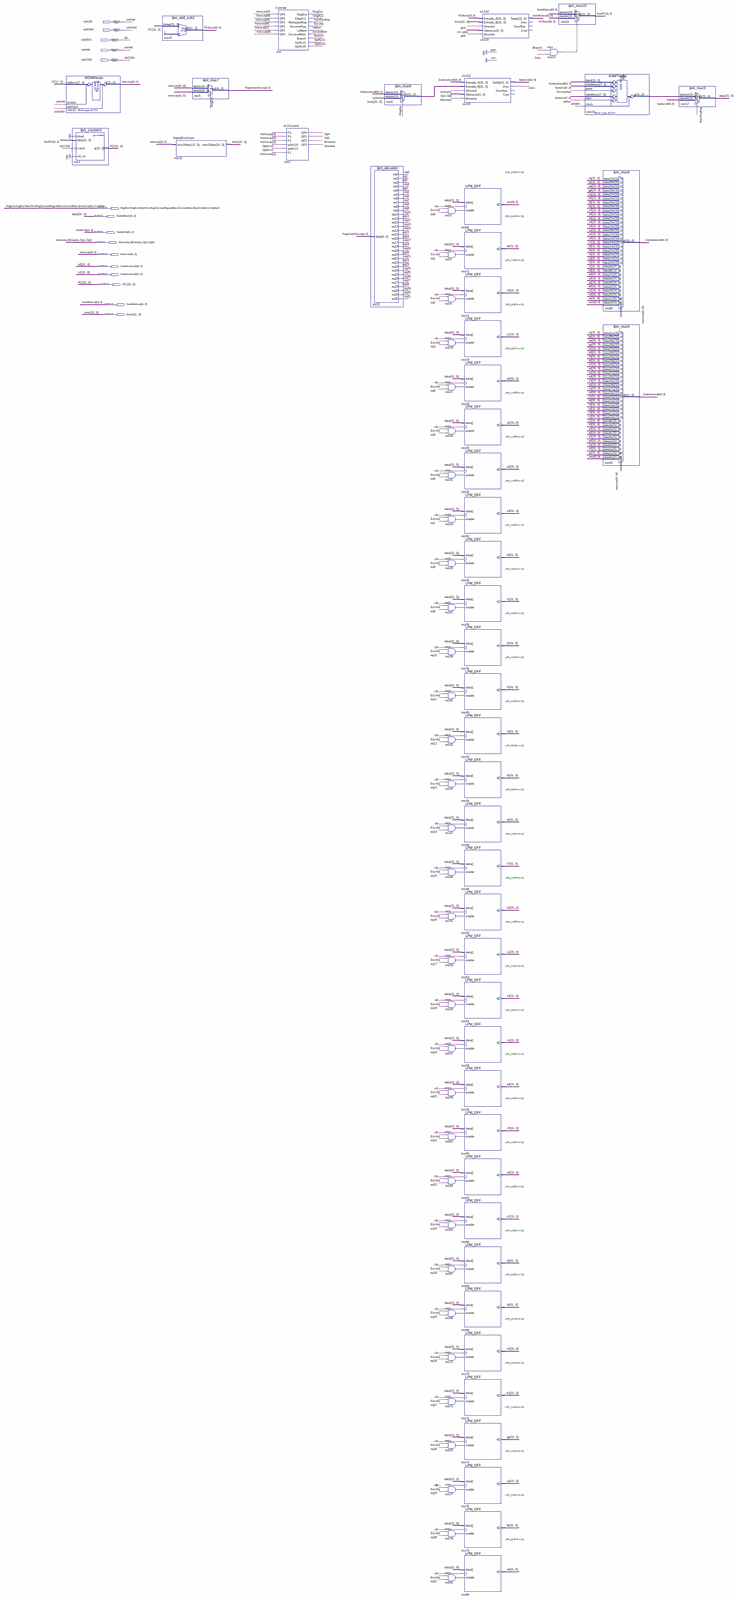
[diagram p0: schematic sheet, whole]
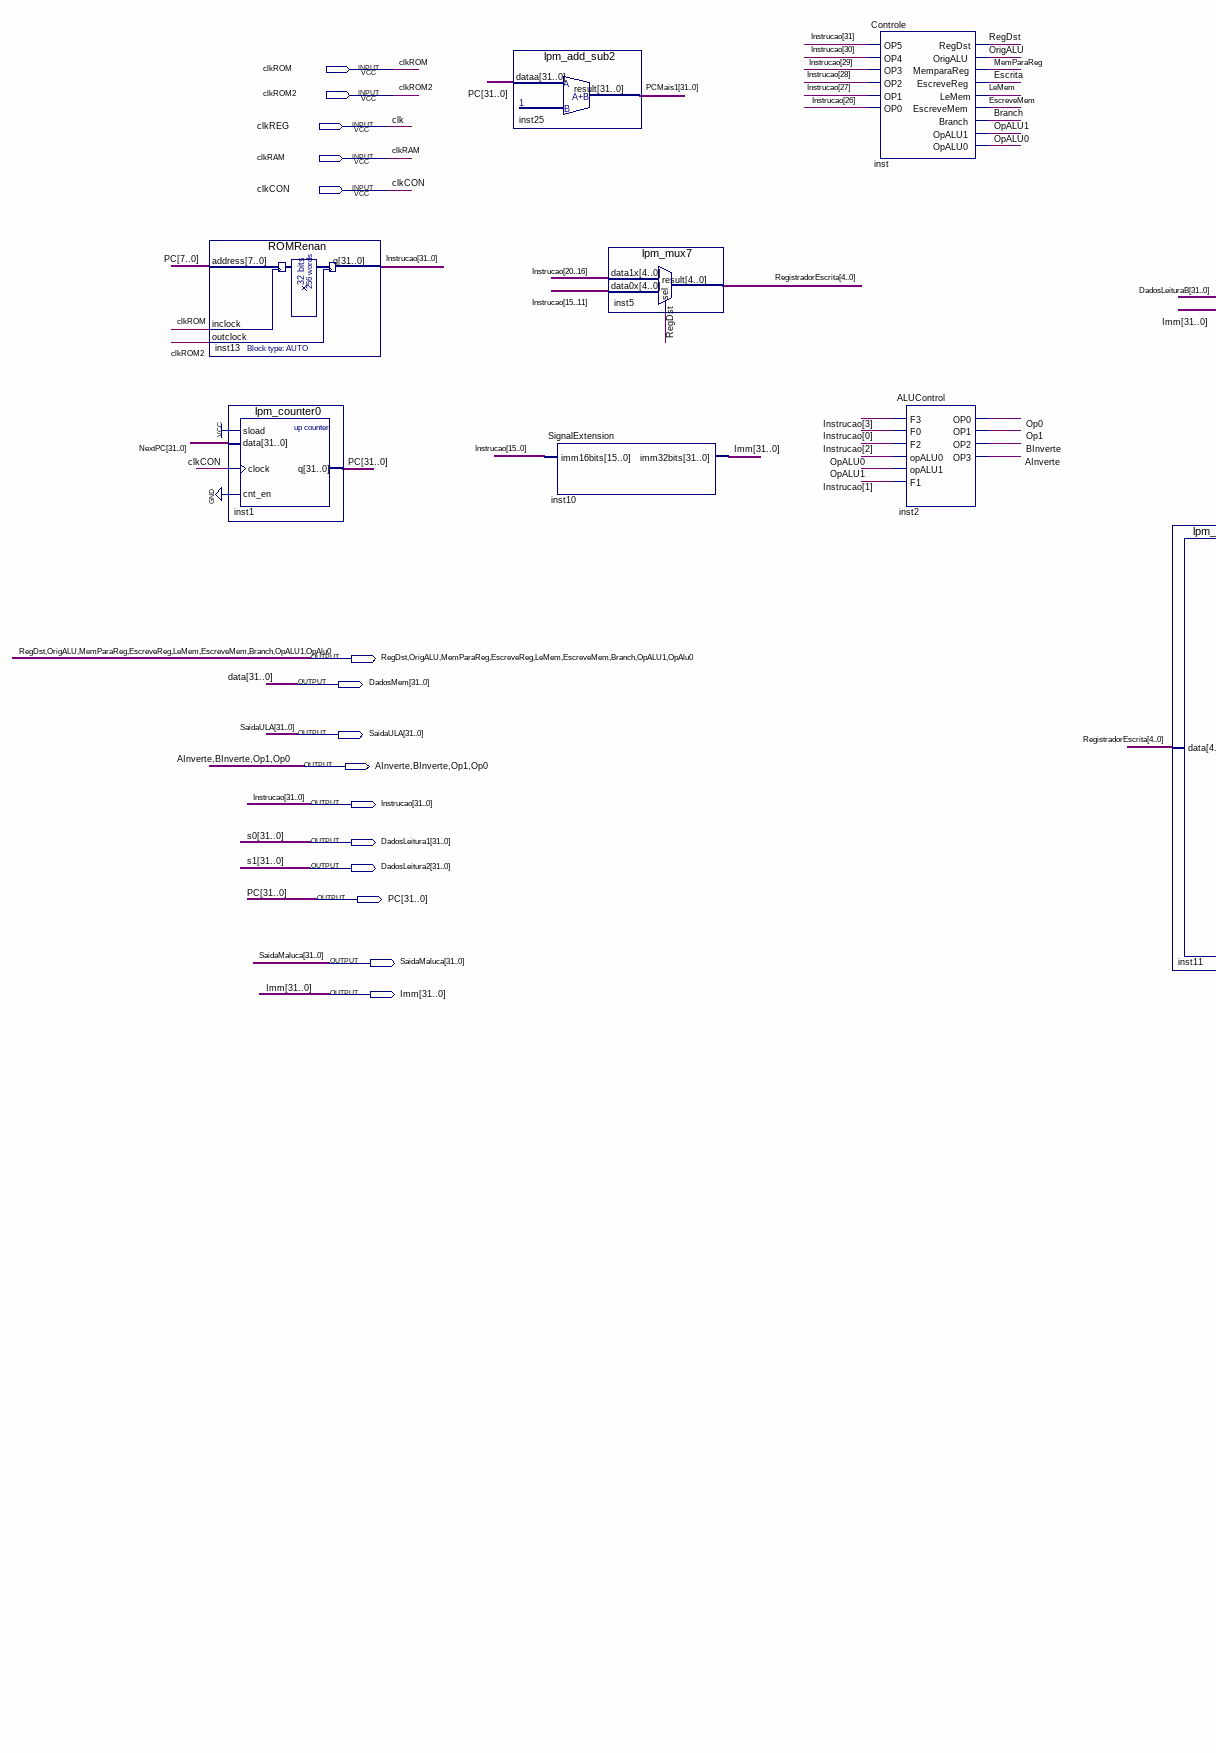
[diagram p1: schematic sheet, upper left part]
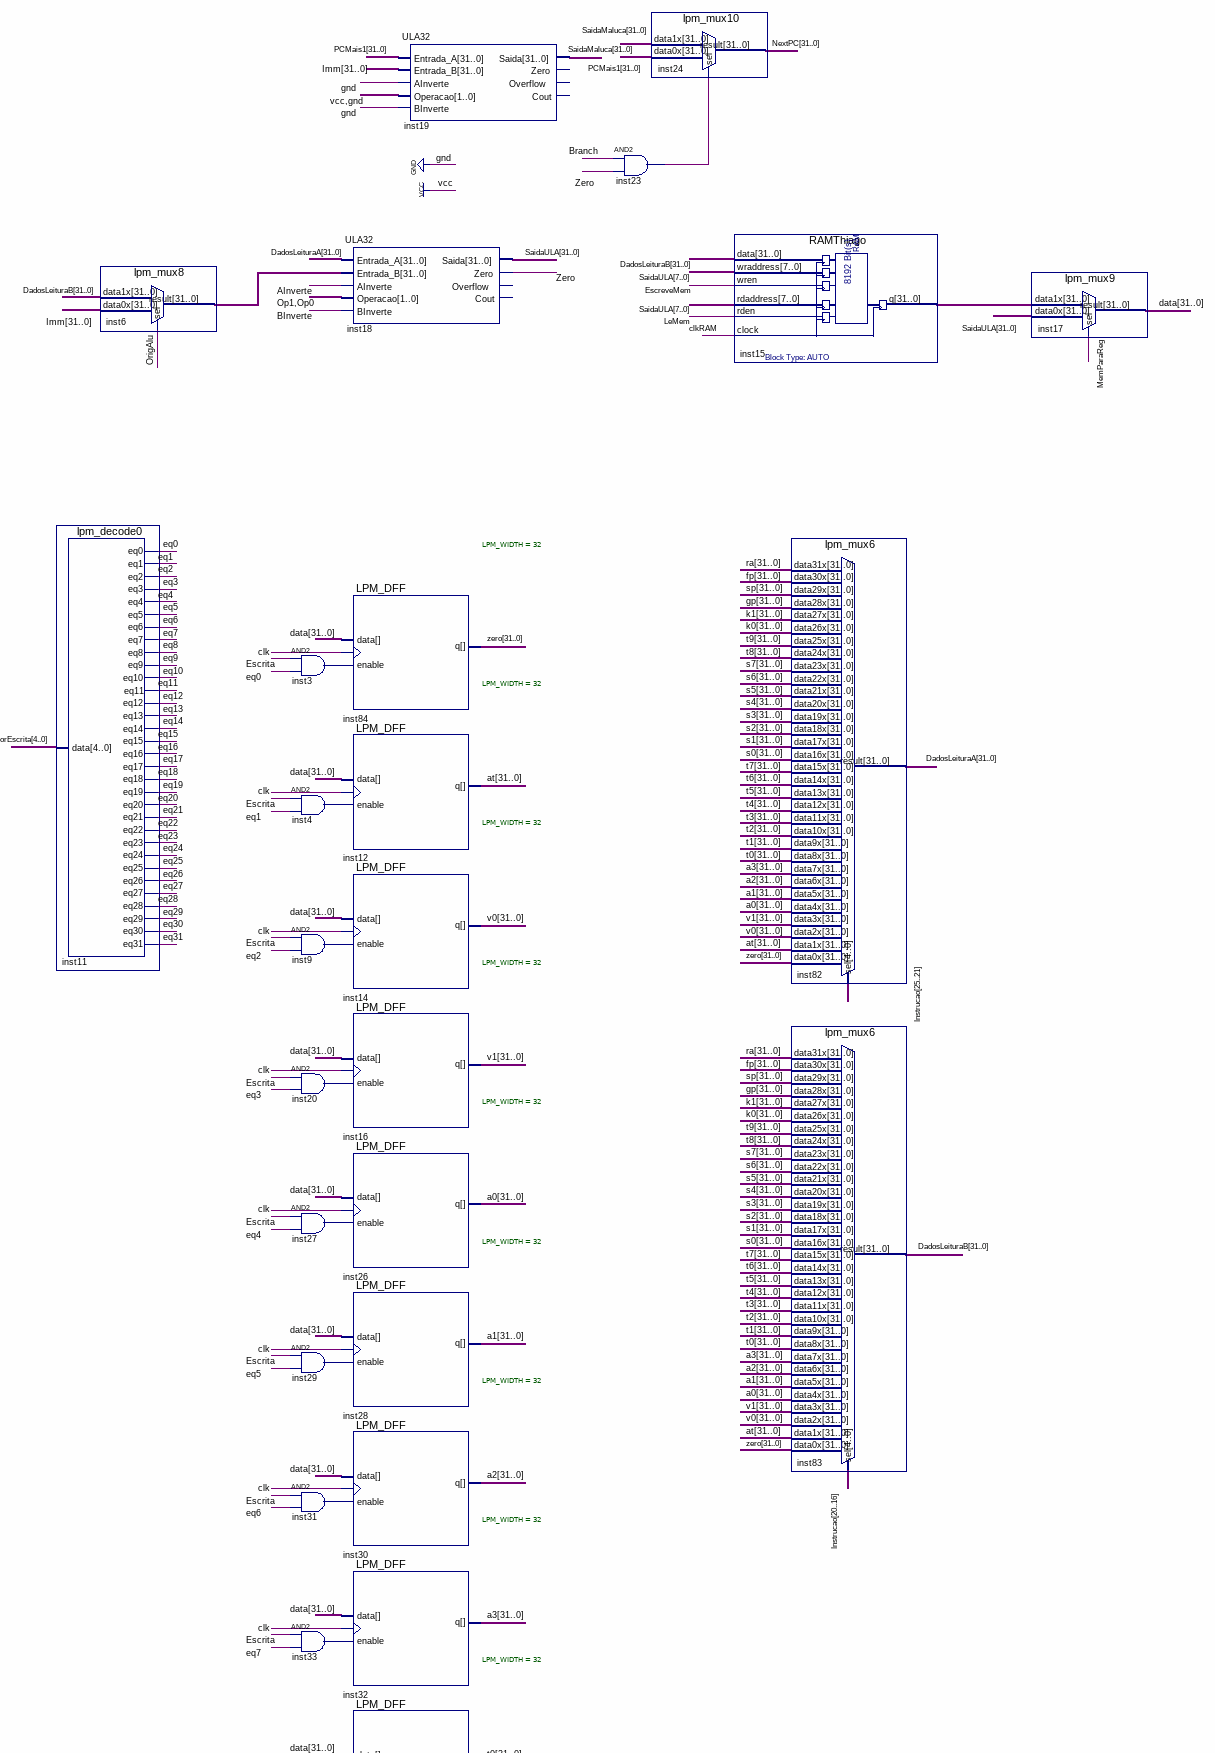
[diagram p2: schematic sheet, upper right part]
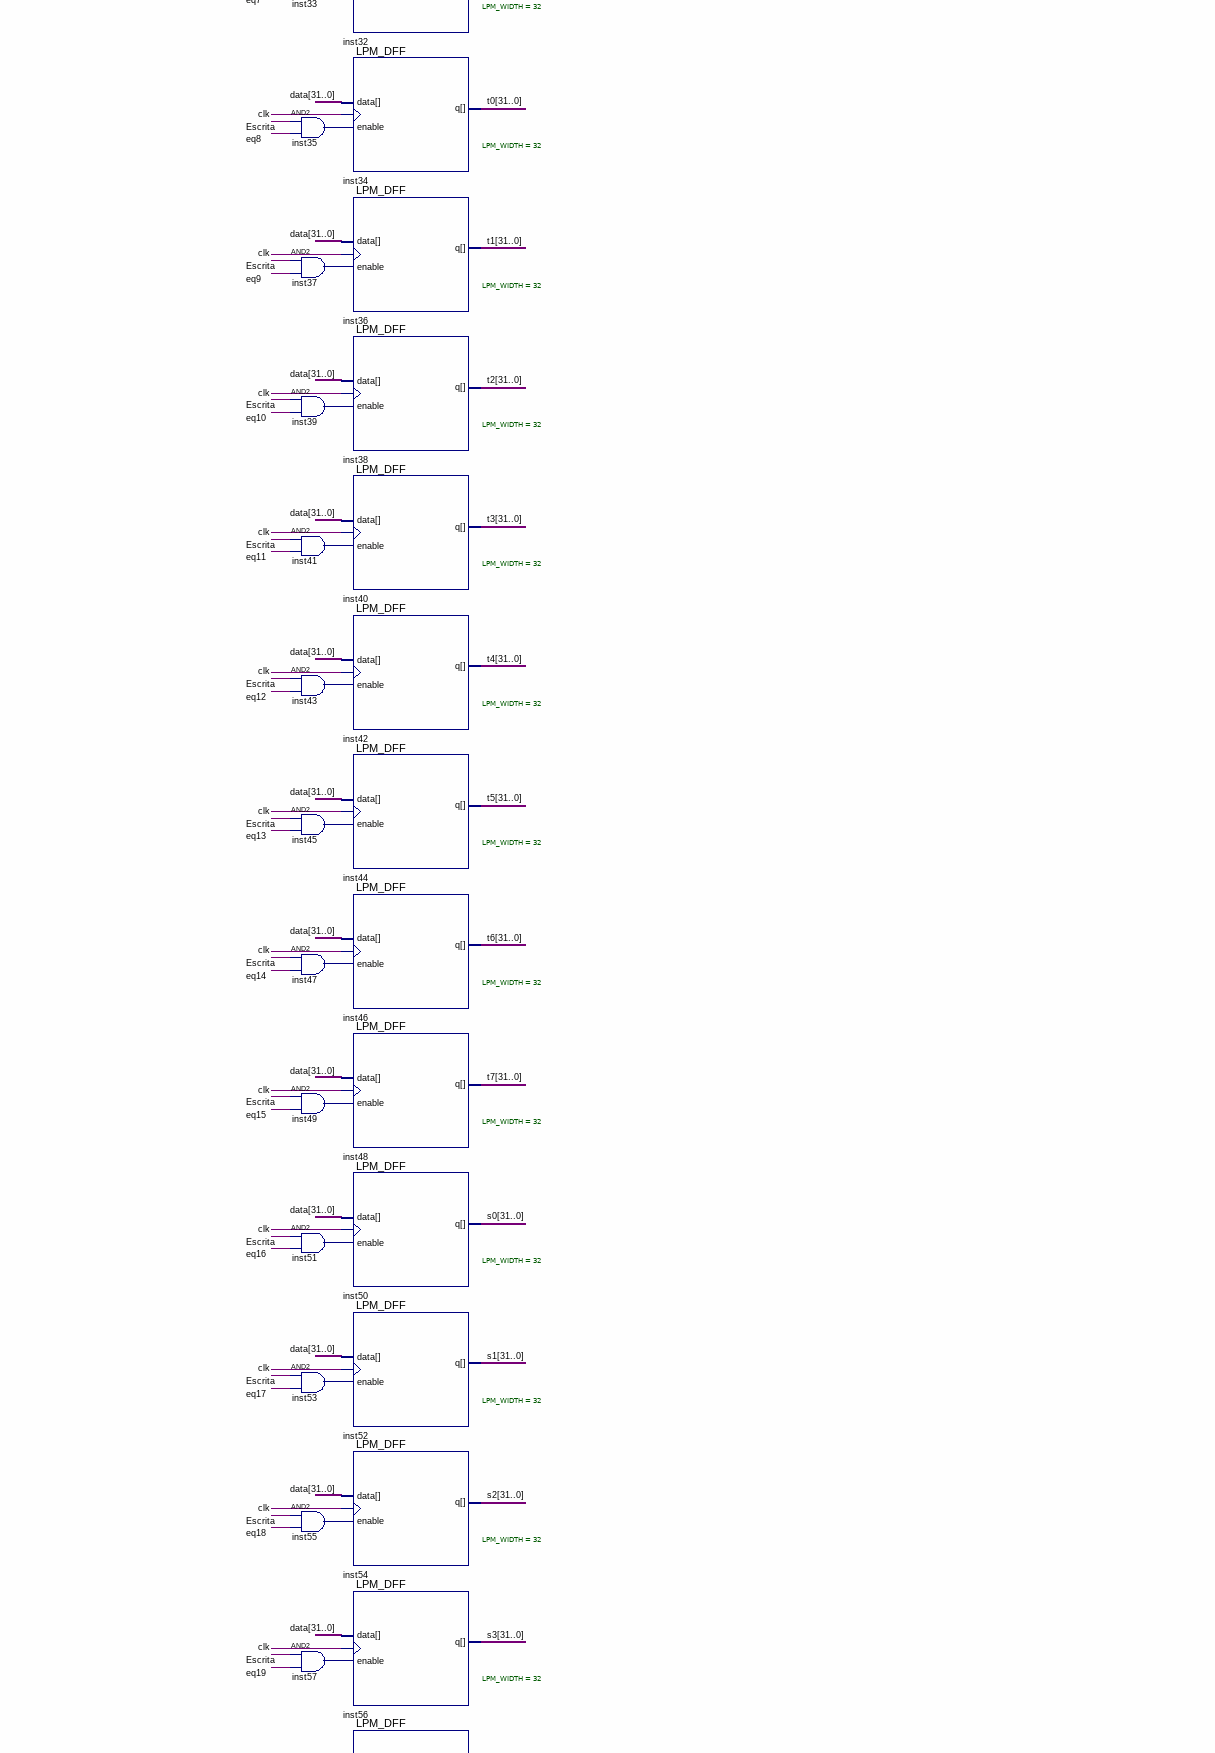
[diagram p3: schematic sheet, middle right part]
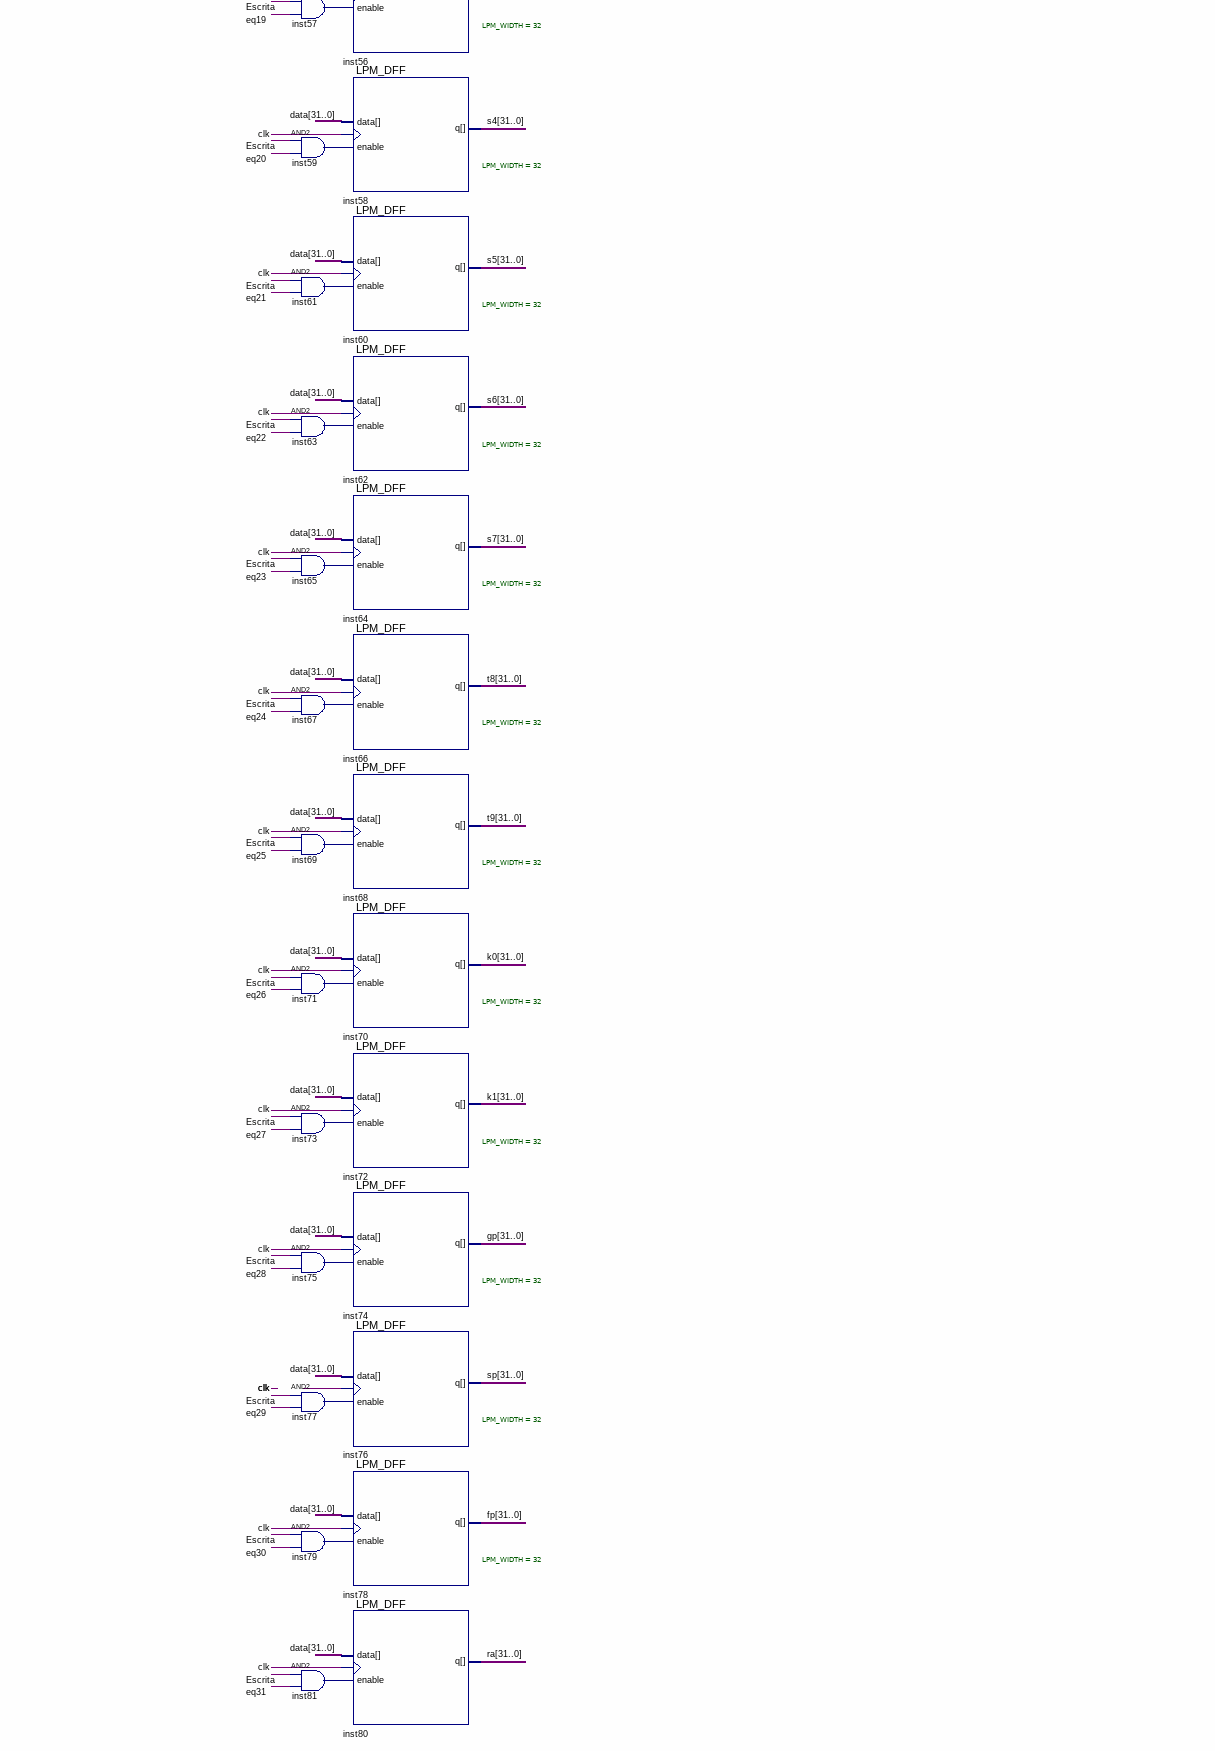
[diagram p4: schematic sheet, lower right part]
// Quartus schematic GambiarraRegD.bdf as structural Verilog: 81 symbols, 15 pins
module GambiarraRegD (
  input  clkROM,
  input  clkROM2,
  input  clkREG,
  input  clkRAM,
  input  clkCON,
  output RegDst,
  output OrigALU,
  output MemParaReg,
  output EscreveReg,
  output LeMem,
  output EscreveMem,
  output Branch,
  output OpALU1,
  output OpAlu0,
  output [31:0] DadosMem,
  output [31:0] SaidaULA,
  output AInverte,
  output BInverte,
  output Op1,
  output Op0,
  output [31:0] Instrucao,
  output [31:0] DadosLeitura1,
  output [31:0] DadosLeitura2,
  output [31:0] PC,
  output [31:0] SaidaMaluca,
  output [31:0] Imm
);

  wire eq0, eq1, eq2, eq3, eq4, eq5, eq6, eq7, eq8, eq9, eq10, eq11, eq12, eq13, eq14, eq15, eq16, eq17,
       eq18, eq19, eq20, eq21, eq22, eq23, eq24, eq25, eq26, eq27, eq28, eq29, eq30, eq31, Escrita,
       inst3_out, inst4_out, inst9_out, inst20_out, inst23_out, inst27_out, inst29_out, inst31_out,
       inst33_out, inst35_out, inst37_out, inst39_out, inst41_out, inst43_out, inst45_out, inst47_out,
       inst49_out, inst51_out, inst53_out, inst55_out, inst57_out, inst59_out, inst61_out, inst63_out,
       inst65_out, inst67_out, inst69_out, inst71_out, inst73_out, inst75_out, inst77_out, inst79_out,
       inst81_out, Zero_1bit;
  wire [4:0] RegistradorEscrita;
  wire [31:0] a0, a1, a2, a3, at, DadosLeituraA, DadosLeituraB, fp, gp, inst6_result, inst15_q, k0, k1,
       NextPC, PCMais1, ra, s2, s3, s4, s5, s6, s7, sp, t0, t1, t2, t3, t4, t5, t6, t7, t8, t9, v0, v1, Zero;

  ROMRenan inst13 (.address(PC[7:0]), .inclock(clkROM), .outclock(clkROM2), .q(Instrucao));
  lpm_counter0 inst1 (.sload(1'b1), .data(NextPC), .clock(clkCON), .cnt_en(1'b0), .q(PC));
  lpm_add_sub2 inst25 (.dataa(PC), .result(PCMais1));
  SignalExtension inst10 (.imm16bits(Instrucao[15:0]), .imm32bits(Imm));
  lpm_mux7 inst5 (.data1x(Instrucao[20:16]), .data0x(Instrucao[15:11]), .sel(RegDst), .result(RegistradorEscrita));
  Controle inst (
    .OP5(Instrucao[31]), .OP4(Instrucao[30]), .OP3(Instrucao[29]), .OP2(Instrucao[28]), .OP1(Instrucao[27]),
    .OP0(Instrucao[26]), .RegDst(RegDst), .OrigALU(OrigALU), .MemparaReg(MemParaReg), .EscreveReg(Escrita),
    .LeMem(LeMem), .EscreveMem(EscreveMem), .Branch(Branch), .OpALU1(OpALU1), .OpALU0(OpAlu0));
  ALUControl inst2 (
    .F3(Instrucao[3]), .F0(Instrucao[0]), .F2(Instrucao[2]), .opALU0(OpAlu0), .opALU1(OpALU1),
    .F1(Instrucao[1]), .OP0(Op0), .OP1(Op1), .OP2(BInverte), .OP3(AInverte));
  lpm_decode0 inst11 (
    .data(RegistradorEscrita), .eq0(eq0), .eq1(eq1), .eq2(eq2), .eq3(eq3), .eq4(eq4), .eq5(eq5), .eq6(eq6),
    .eq7(eq7), .eq8(eq8), .eq9(eq9), .eq10(eq10), .eq11(eq11), .eq12(eq12), .eq13(eq13), .eq14(eq14),
    .eq15(eq15), .eq16(eq16), .eq17(eq17), .eq18(eq18), .eq19(eq19), .eq20(eq20), .eq21(eq21), .eq22(eq22),
    .eq23(eq23), .eq24(eq24), .eq25(eq25), .eq26(eq26), .eq27(eq27), .eq28(eq28), .eq29(eq29), .eq30(eq30),
    .eq31(eq31));
  lpm_mux8 inst6 (.data1x(DadosLeituraB), .data0x(Imm), .sel(OrigALU), .result(inst6_result));
  and inst3 (inst3_out, Escrita, eq0);
  and inst4 (inst4_out, Escrita, eq1);
  and inst9 (inst9_out, Escrita, eq2);
  and inst20 (inst20_out, Escrita, eq3);
  and inst27 (inst27_out, Escrita, eq4);
  and inst29 (inst29_out, Escrita, eq5);
  and inst31 (inst31_out, Escrita, eq6);
  and inst33 (inst33_out, Escrita, eq7);
  and inst35 (inst35_out, Escrita, eq8);
  and inst37 (inst37_out, Escrita, eq9);
  and inst39 (inst39_out, Escrita, eq10);
  and inst41 (inst41_out, Escrita, eq11);
  and inst43 (inst43_out, Escrita, eq12);
  and inst45 (inst45_out, Escrita, eq13);
  and inst47 (inst47_out, Escrita, eq14);
  and inst49 (inst49_out, Escrita, eq15);
  and inst51 (inst51_out, Escrita, eq16);
  and inst53 (inst53_out, Escrita, eq17);
  and inst55 (inst55_out, Escrita, eq18);
  and inst57 (inst57_out, Escrita, eq19);
  and inst59 (inst59_out, Escrita, eq20);
  and inst61 (inst61_out, Escrita, eq21);
  and inst63 (inst63_out, Escrita, eq22);
  and inst65 (inst65_out, Escrita, eq23);
  and inst67 (inst67_out, Escrita, eq24);
  and inst69 (inst69_out, Escrita, eq25);
  and inst71 (inst71_out, Escrita, eq26);
  and inst73 (inst73_out, Escrita, eq27);
  and inst75 (inst75_out, Escrita, eq28);
  and inst77 (inst77_out, Escrita, eq29);
  and inst79 (inst79_out, Escrita, eq30);
  and inst81 (inst81_out, Escrita, eq31);
  ULA32 inst18 (
    .Entrada_A(DadosLeituraA), .Entrada_B(inst6_result), .AInverte(AInverte), .Operacao({Op1, Op0}),
    .BInverte(BInverte), .Saida(SaidaULA), .Zero(Zero_1bit));  // open: Overflow, Cout
  LPM_DFF #(.LPM_WIDTH(32)) inst84 (.clock(clkREG), .data(DadosMem), .enable(inst3_out), .q(Zero));
  LPM_DFF #(.LPM_WIDTH(32)) inst12 (.clock(clkREG), .data(DadosMem), .enable(inst4_out), .q(at));
  LPM_DFF #(.LPM_WIDTH(32)) inst14 (.clock(clkREG), .data(DadosMem), .enable(inst9_out), .q(v0));
  LPM_DFF #(.LPM_WIDTH(32)) inst16 (.clock(clkREG), .data(DadosMem), .enable(inst20_out), .q(v1));
  LPM_DFF #(.LPM_WIDTH(32)) inst26 (.clock(clkREG), .data(DadosMem), .enable(inst27_out), .q(a0));
  LPM_DFF #(.LPM_WIDTH(32)) inst28 (.clock(clkREG), .data(DadosMem), .enable(inst29_out), .q(a1));
  LPM_DFF #(.LPM_WIDTH(32)) inst30 (.clock(clkREG), .data(DadosMem), .enable(inst31_out), .q(a2));
  LPM_DFF #(.LPM_WIDTH(32)) inst32 (.clock(clkREG), .data(DadosMem), .enable(inst33_out), .q(a3));
  LPM_DFF #(.LPM_WIDTH(32)) inst34 (.clock(clkREG), .data(DadosMem), .enable(inst35_out), .q(t0));
  LPM_DFF #(.LPM_WIDTH(32)) inst36 (.clock(clkREG), .data(DadosMem), .enable(inst37_out), .q(t1));
  LPM_DFF #(.LPM_WIDTH(32)) inst38 (.clock(clkREG), .data(DadosMem), .enable(inst39_out), .q(t2));
  LPM_DFF #(.LPM_WIDTH(32)) inst40 (.clock(clkREG), .data(DadosMem), .enable(inst41_out), .q(t3));
  LPM_DFF #(.LPM_WIDTH(32)) inst42 (.clock(clkREG), .data(DadosMem), .enable(inst43_out), .q(t4));
  LPM_DFF #(.LPM_WIDTH(32)) inst44 (.clock(clkREG), .data(DadosMem), .enable(inst45_out), .q(t5));
  LPM_DFF #(.LPM_WIDTH(32)) inst46 (.clock(clkREG), .data(DadosMem), .enable(inst47_out), .q(t6));
  LPM_DFF #(.LPM_WIDTH(32)) inst48 (.clock(clkREG), .data(DadosMem), .enable(inst49_out), .q(t7));
  LPM_DFF #(.LPM_WIDTH(32)) inst50 (.clock(clkREG), .data(DadosMem), .enable(inst51_out), .q(DadosLeitura1));
  LPM_DFF #(.LPM_WIDTH(32)) inst52 (.clock(clkREG), .data(DadosMem), .enable(inst53_out), .q(DadosLeitura2));
  LPM_DFF #(.LPM_WIDTH(32)) inst54 (.clock(clkREG), .data(DadosMem), .enable(inst55_out), .q(s2));
  LPM_DFF #(.LPM_WIDTH(32)) inst56 (.clock(clkREG), .data(DadosMem), .enable(inst57_out), .q(s3));
  LPM_DFF #(.LPM_WIDTH(32)) inst58 (.clock(clkREG), .data(DadosMem), .enable(inst59_out), .q(s4));
  LPM_DFF #(.LPM_WIDTH(32)) inst60 (.clock(clkREG), .data(DadosMem), .enable(inst61_out), .q(s5));
  LPM_DFF #(.LPM_WIDTH(32)) inst62 (.clock(clkREG), .data(DadosMem), .enable(inst63_out), .q(s6));
  LPM_DFF #(.LPM_WIDTH(32)) inst64 (.clock(clkREG), .data(DadosMem), .enable(inst65_out), .q(s7));
  LPM_DFF #(.LPM_WIDTH(32)) inst66 (.clock(clkREG), .data(DadosMem), .enable(inst67_out), .q(t8));
  LPM_DFF #(.LPM_WIDTH(32)) inst68 (.clock(clkREG), .data(DadosMem), .enable(inst69_out), .q(t9));
  LPM_DFF #(.LPM_WIDTH(32)) inst70 (.clock(clkREG), .data(DadosMem), .enable(inst71_out), .q(k0));
  LPM_DFF #(.LPM_WIDTH(32)) inst72 (.clock(clkREG), .data(DadosMem), .enable(inst73_out), .q(k1));
  LPM_DFF #(.LPM_WIDTH(32)) inst74 (.clock(clkREG), .data(DadosMem), .enable(inst75_out), .q(gp));
  LPM_DFF #(.LPM_WIDTH(32)) inst76 (.clock(clkREG), .data(DadosMem), .enable(inst77_out), .q(sp));
  LPM_DFF #(.LPM_WIDTH(32)) inst78 (.clock(clkREG), .data(DadosMem), .enable(inst79_out), .q(fp));
  LPM_DFF #(.LPM_WIDTH(32)) inst80 (.clock(clkREG), .data(DadosMem), .enable(inst81_out), .q(ra));
  ULA32 inst19 (
    .Entrada_A(PCMais1), .Entrada_B(Imm), .AInverte(1'b0), .Operacao(2'b10), .BInverte(1'b0),
    .Saida(SaidaMaluca));  // open: Zero, Overflow, Cout
  and inst23 (inst23_out, Branch, Zero_1bit);
  lpm_mux10 inst24 (.data1x(SaidaMaluca), .data0x(PCMais1), .sel(inst23_out), .result(NextPC));
  RAMThiago inst15 (
    .data(DadosLeituraB), .wraddress(SaidaULA[7:0]), .wren(EscreveMem), .rdaddress(SaidaULA[7:0]),
    .rden(LeMem), .clock(clkRAM), .q(inst15_q));
  lpm_mux6 inst82 (
    .data31x(ra), .data30x(fp), .data29x(sp), .data28x(gp), .data27x(k1), .data26x(k0), .data25x(t9),
    .data24x(t8), .data23x(s7), .data22x(s6), .data21x(s5), .data20x(s4), .data19x(s3), .data18x(s2),
    .data17x(DadosLeitura2), .data16x(DadosLeitura1), .data15x(t7), .data14x(t6), .data13x(t5), .data12x(t4),
    .data11x(t3), .data10x(t2), .data9x(t1), .data8x(t0), .data7x(a3), .data6x(a2), .data5x(a1), .data4x(a0),
    .data3x(v1), .data2x(v0), .data1x(at), .data0x(Zero), .sel(Instrucao[25:21]), .result(DadosLeituraA));
  lpm_mux6 inst83 (
    .data31x(ra), .data30x(fp), .data29x(sp), .data28x(gp), .data27x(k1), .data26x(k0), .data25x(t9),
    .data24x(t8), .data23x(s7), .data22x(s6), .data21x(s5), .data20x(s4), .data19x(s3), .data18x(s2),
    .data17x(DadosLeitura2), .data16x(DadosLeitura1), .data15x(t7), .data14x(t6), .data13x(t5), .data12x(t4),
    .data11x(t3), .data10x(t2), .data9x(t1), .data8x(t0), .data7x(a3), .data6x(a2), .data5x(a1), .data4x(a0),
    .data3x(v1), .data2x(v0), .data1x(at), .data0x(Zero), .sel(Instrucao[20:16]), .result(DadosLeituraB));
  lpm_mux9 inst17 (.data1x(inst15_q), .data0x(SaidaULA), .sel(MemParaReg), .result(DadosMem));

  // Other names for the same wires on the sheet: clk = clkREG; data[31:0] = DadosMem; s0[31:0] = DadosLeitura1;
  //   s1[31:0] = DadosLeitura2
endmodule
